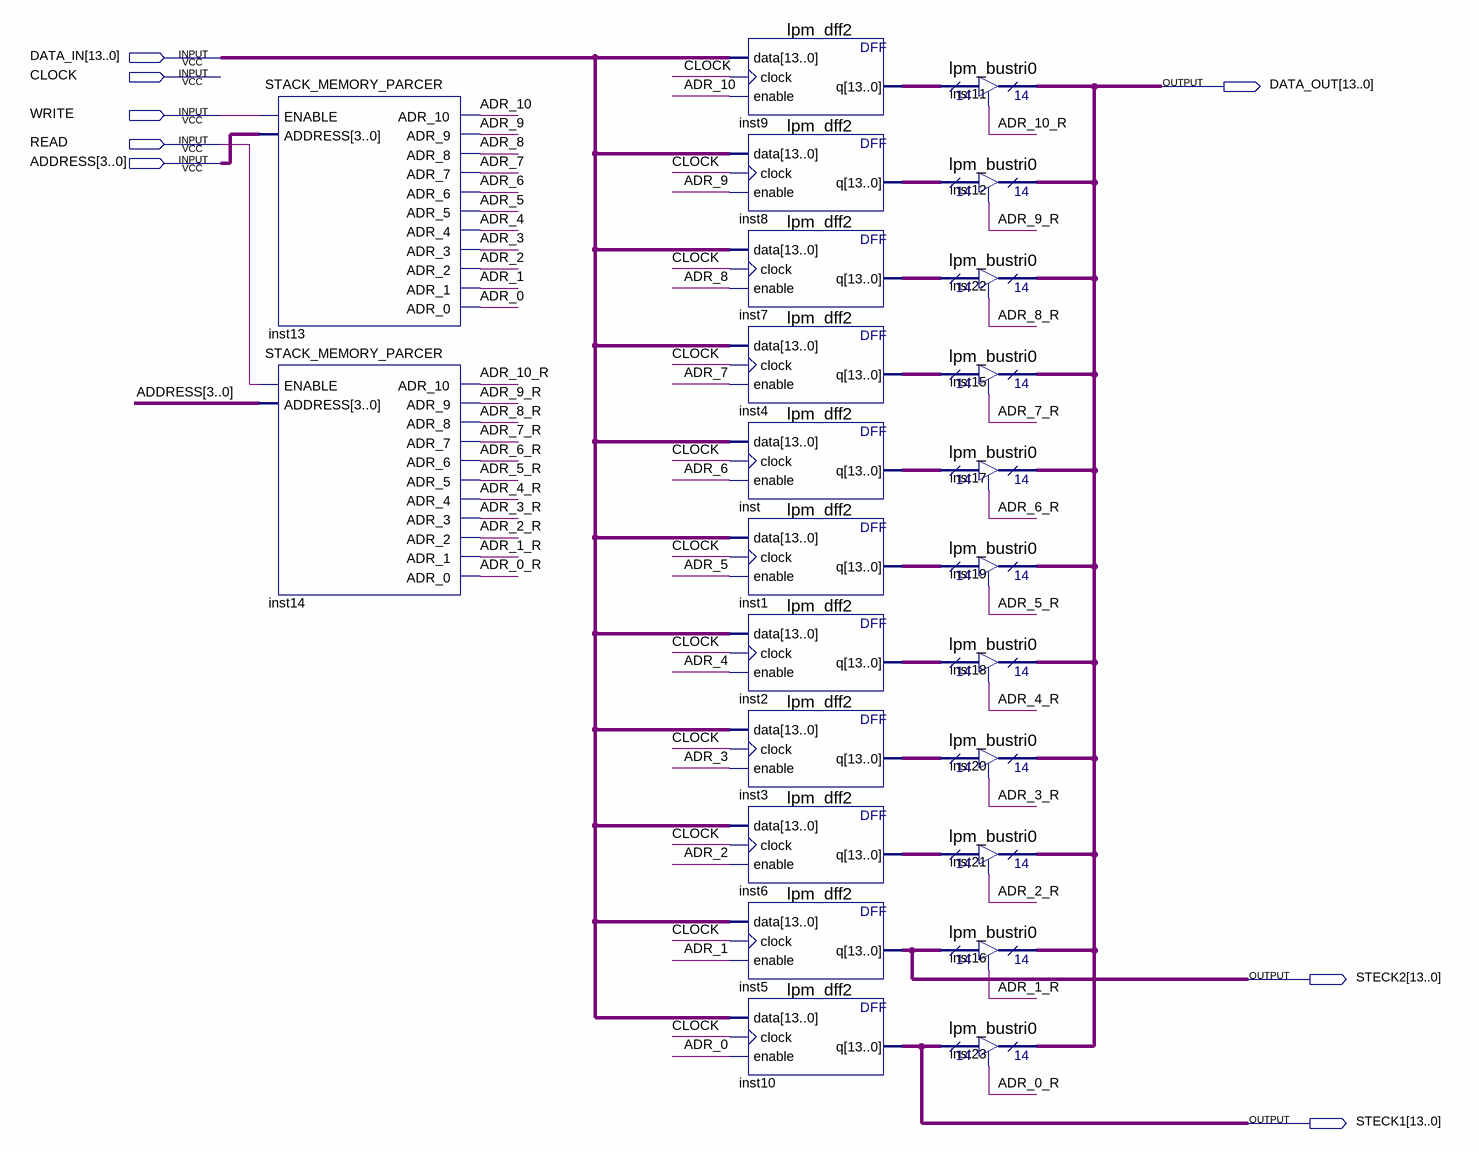
[diagram p0: schematic sheet]
// Quartus schematic STACK_MEMORY.bdf as structural Verilog: 24 symbols, 8 pins
module STACK_MEMORY (
  input  [13:0] DATA_IN,
  input  CLOCK,
  input  WRITE,
  input  READ,
  input  [3:0] ADDRESS,
  output [13:0] DATA_OUT,
  output [13:0] STECK2,
  output [13:0] STECK1
);

  wire ADR_0, ADR_0_R, ADR_1, ADR_1_R, ADR_2, ADR_2_R, ADR_3, ADR_3_R, ADR_4, ADR_4_R, ADR_5, ADR_5_R, ADR_6,
       ADR_6_R, ADR_7, ADR_7_R, ADR_8, ADR_8_R, ADR_9, ADR_9_R, ADR_10, ADR_10_R;
  wire [13:0] inst1_q, inst2_q, inst3_q, inst4_q, inst6_q, inst7_q, inst8_q, inst9_q, inst_q;

  STACK_MEMORY_PARCER inst13 (
    .ENABLE(WRITE), .ADDRESS(ADDRESS), .ADR_10(ADR_10), .ADR_9(ADR_9), .ADR_8(ADR_8), .ADR_7(ADR_7),
    .ADR_6(ADR_6), .ADR_5(ADR_5), .ADR_4(ADR_4), .ADR_3(ADR_3), .ADR_2(ADR_2), .ADR_1(ADR_1), .ADR_0(ADR_0));
  STACK_MEMORY_PARCER inst14 (
    .ENABLE(READ), .ADDRESS(ADDRESS), .ADR_10(ADR_10_R), .ADR_9(ADR_9_R), .ADR_8(ADR_8_R), .ADR_7(ADR_7_R),
    .ADR_6(ADR_6_R), .ADR_5(ADR_5_R), .ADR_4(ADR_4_R), .ADR_3(ADR_3_R), .ADR_2(ADR_2_R), .ADR_1(ADR_1_R),
    .ADR_0(ADR_0_R));
  lpm_dff2 inst9 (.data(DATA_IN), .clock(CLOCK), .enable(ADR_10), .q(inst9_q));
  lpm_dff2 inst8 (.data(DATA_IN), .clock(CLOCK), .enable(ADR_9), .q(inst8_q));
  lpm_dff2 inst7 (.data(DATA_IN), .clock(CLOCK), .enable(ADR_8), .q(inst7_q));
  lpm_dff2 inst4 (.data(DATA_IN), .clock(CLOCK), .enable(ADR_7), .q(inst4_q));
  lpm_dff2 inst (.data(DATA_IN), .clock(CLOCK), .enable(ADR_6), .q(inst_q));
  lpm_dff2 inst1 (.data(DATA_IN), .clock(CLOCK), .enable(ADR_5), .q(inst1_q));
  lpm_dff2 inst2 (.data(DATA_IN), .clock(CLOCK), .enable(ADR_4), .q(inst2_q));
  lpm_dff2 inst3 (.data(DATA_IN), .clock(CLOCK), .enable(ADR_3), .q(inst3_q));
  lpm_dff2 inst6 (.data(DATA_IN), .clock(CLOCK), .enable(ADR_2), .q(inst6_q));
  lpm_dff2 inst5 (.data(DATA_IN), .clock(CLOCK), .enable(ADR_1), .q(STECK2));
  lpm_dff2 inst10 (.data(DATA_IN), .clock(CLOCK), .enable(ADR_0), .q(STECK1));
  lpm_bustri0 inst11 (.enabledt(ADR_10_R), .data(inst9_q), .tridata(DATA_OUT));
  lpm_bustri0 inst12 (.enabledt(ADR_9_R), .data(inst8_q), .tridata(DATA_OUT));
  lpm_bustri0 inst22 (.enabledt(ADR_8_R), .data(inst7_q), .tridata(DATA_OUT));
  lpm_bustri0 inst15 (.enabledt(ADR_7_R), .data(inst4_q), .tridata(DATA_OUT));
  lpm_bustri0 inst17 (.enabledt(ADR_6_R), .data(inst_q), .tridata(DATA_OUT));
  lpm_bustri0 inst19 (.enabledt(ADR_5_R), .data(inst1_q), .tridata(DATA_OUT));
  lpm_bustri0 inst18 (.enabledt(ADR_4_R), .data(inst2_q), .tridata(DATA_OUT));
  lpm_bustri0 inst20 (.enabledt(ADR_3_R), .data(inst3_q), .tridata(DATA_OUT));
  lpm_bustri0 inst21 (.enabledt(ADR_2_R), .data(inst6_q), .tridata(DATA_OUT));
  lpm_bustri0 inst16 (.enabledt(ADR_1_R), .data(STECK2), .tridata(DATA_OUT));
  lpm_bustri0 inst23 (.enabledt(ADR_0_R), .data(STECK1), .tridata(DATA_OUT));
endmodule
